# Altium project Sbot_Project.PrjPcb
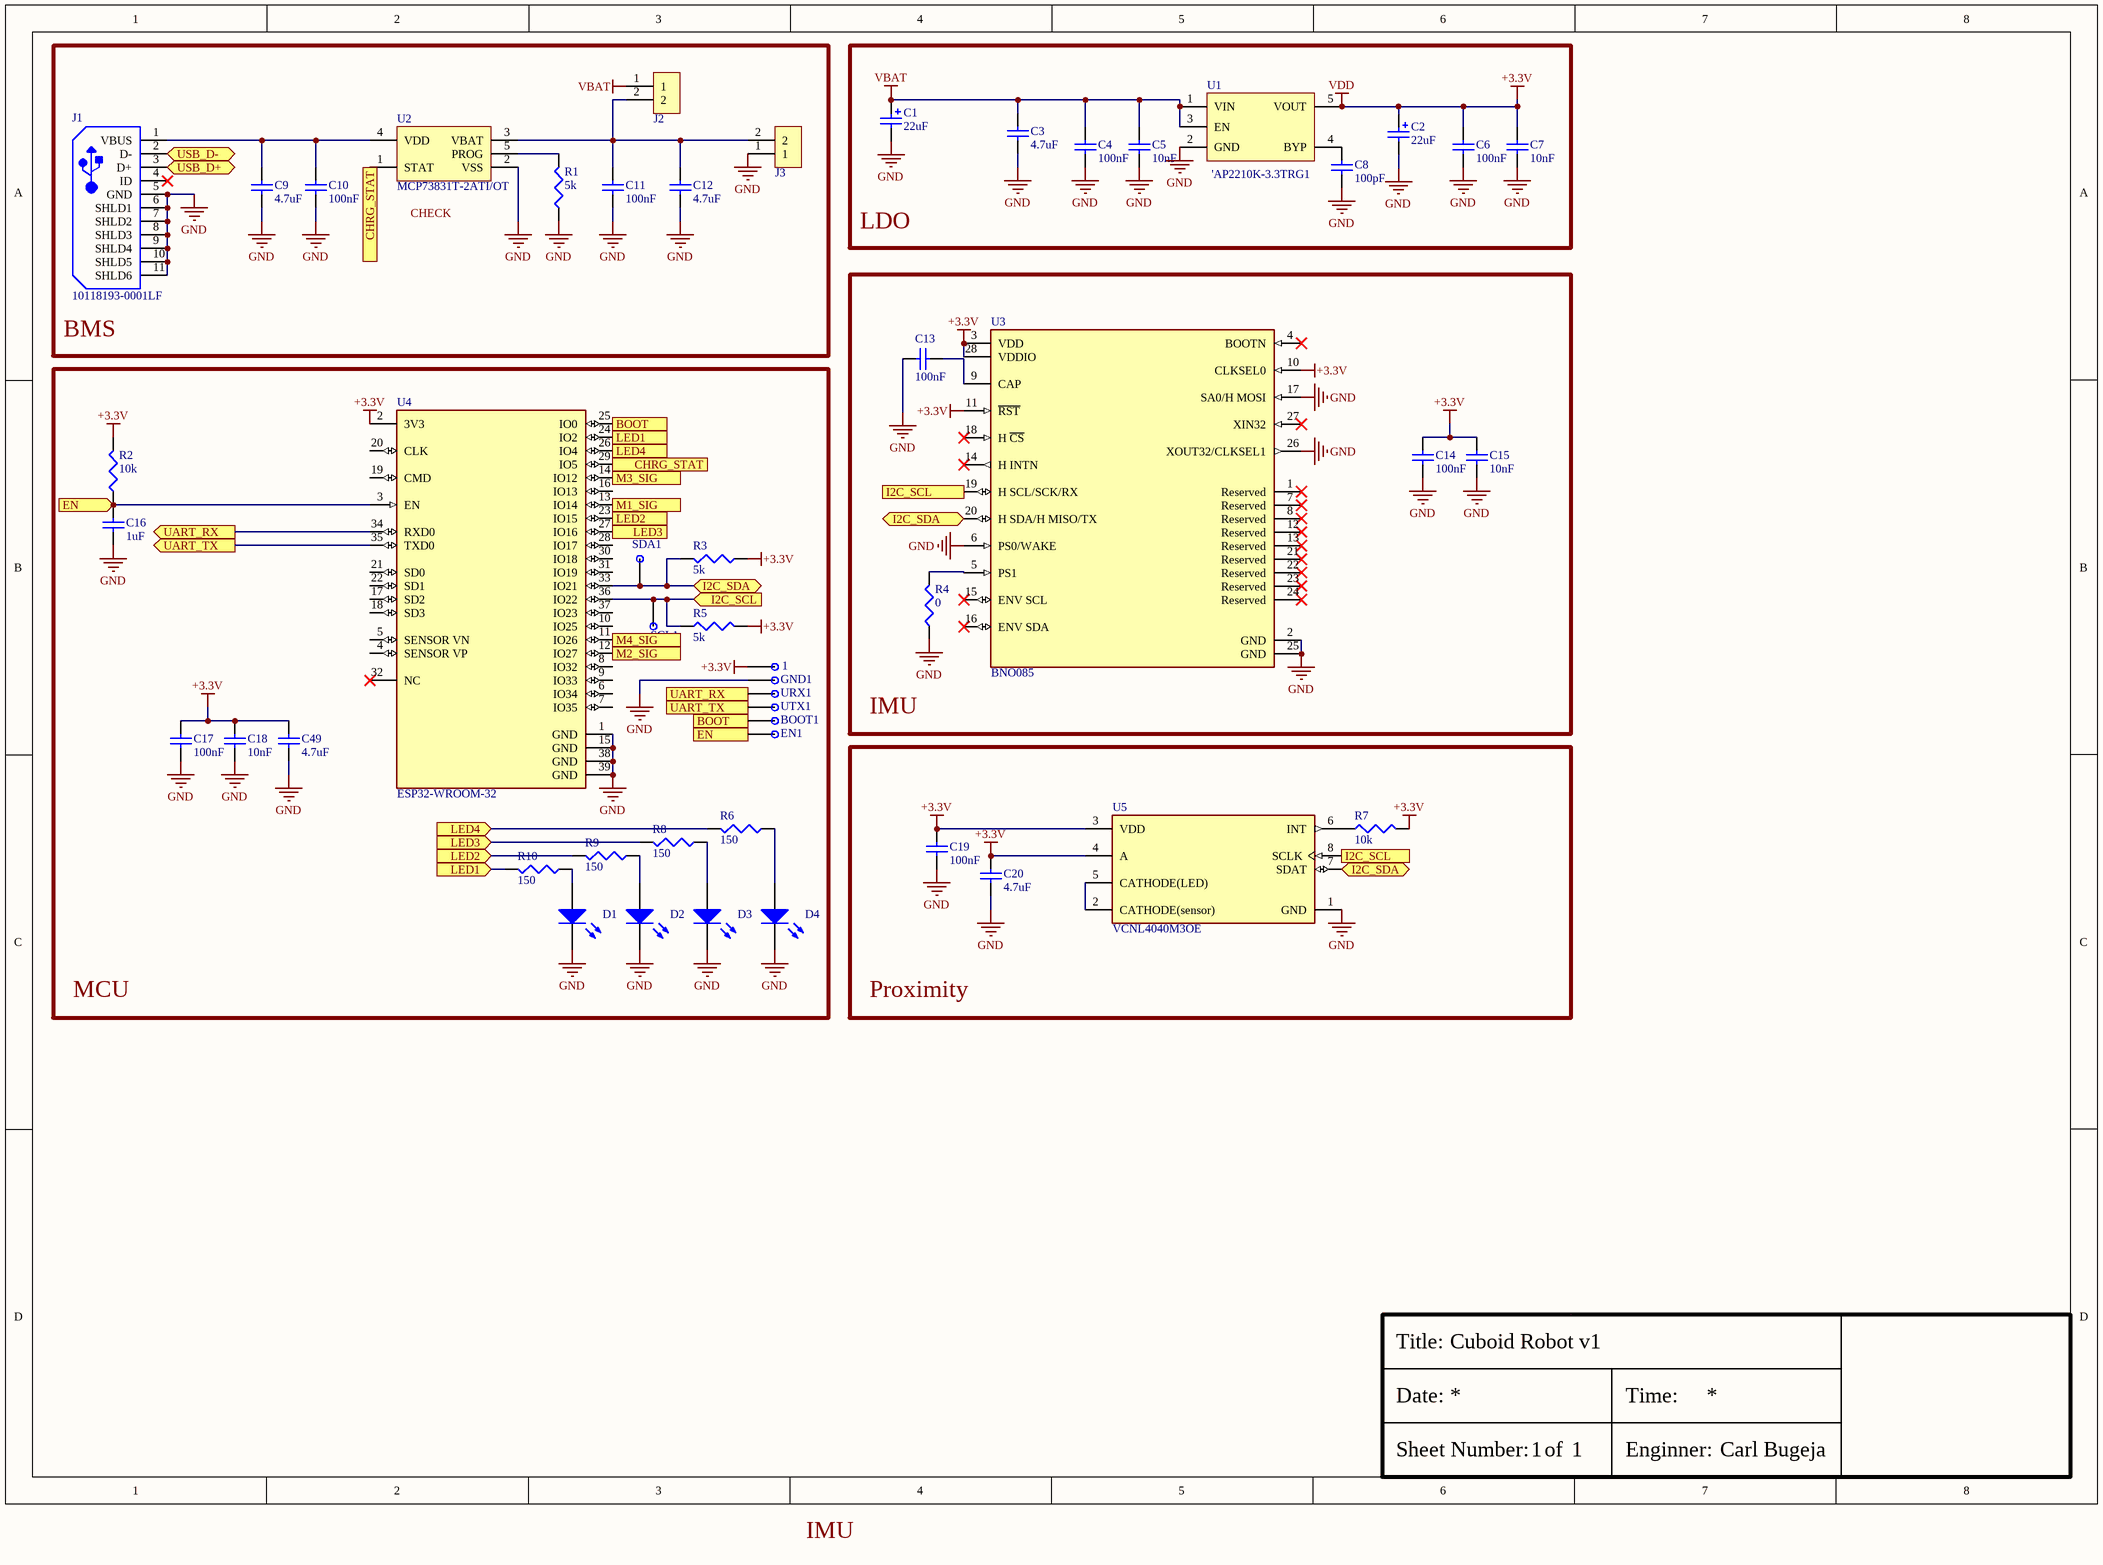
[diagram p0: Sheet1.SchDoc]
Title: Cuboid Robot v1
2 sheets, 119 parts. Net scope: flat (ports and power ports of the same name join across sheets).
Board file: PCB1.PcbDoc
Sheets:
  Sheet1.SchDoc
  Sheet2.SchDoc

## Sheet Sheet1.SchDoc: Cuboid Robot v1
size A3; SheetNumber: 1; SheetTotal: 2

### Parts
1  TESTPAD  [TESTPAD]  (value not drawn)
BOOT1  TESTPAD  [TESTPAD]  (value not drawn)
C1  22uF  [CAPAE4343X55M]
C2  22uF  [CAPAE4343X55M]
C3  4.7uF  [RESC1005X03N]
C4  100nF  [RESC1005X03N]
C5  10nF  [RESC1005X03N]
C6  100nF  [RESC1005X03N]
C7  10nF  [RESC1005X03N]
C8  100pF  [RESC1005X03N]
C9  4.7uF  [RESC1005X03N]
C10  100nF  [RESC1005X03N]
C11  100nF  [RESC1005X03N]
C12  4.7uF  [RESC1005X03N]
C13  100nF  [RESC1005X03N]
C14  100nF  [RESC1005X03N]
C15  10nF  [RESC1005X03N]
C16  1uF  [RESC1005X03N]
C17  100nF  [RESC1005X03N]
C18  10nF  [RESC1005X03N]
C19  100nF  [RESC1005X03N]
C20  4.7uF  [RESC1005X03N]
C49  4.7uF  [RESC1005X03N]
D1  156120VS75000  [1206  RECTANGULAR-REVERSE USE]  (value not drawn)
D2  156120VS75000  [1206  RECTANGULAR-REVERSE USE]  (value not drawn)
D3  156120VS75000  [1206  RECTANGULAR-REVERSE USE]  (value not drawn)
D4  156120VS75000  [1206  RECTANGULAR-REVERSE USE]  (value not drawn)
EN1  TESTPAD  [TESTPAD]  (value not drawn)
GND1  TESTPAD  [TESTPAD]  (value not drawn)
J1  10118193-0001LF  [FCI-10118193-0001LF-5_V]
J2  H2P2.54  [M20-8890245R]  (value not drawn)
J3  H2P2.54  [T2P2.54]  (value not drawn)
R1  5k  [RESC1005X03N]
R2  10k  [RESC1005X03N]
R3  5k  [RESC1005X03N]
R4  0  [RESC1005X03N]
R5  5k  [RESC1005X03N]
R6  150  [RESC1005X03N]
R7  10k  [RESC1005X03N]
R8  150  [RESC1005X03N]
R9  150  [RESC1005X03N]
R10  150  [RESC1005X03N]
SCL1  TESTPAD  [TESTPAD]  (value not drawn)
SDA1  TESTPAD  [TESTPAD]  (value not drawn)
U1  'AP2210K-3.3TRG1  [SOT95P282X145-5N]
U2  MCP73831T-2ATI/OT  [SOT95P270X145-5N]
U3  BNO085  [FP-BNO085-MFG]
U4  ESP32-WROOM-32  [FP-ESP32-WROOM-32-MFG]
U5  VCNL4040M3OE  [FP-VCNL4040M3OE-MFG]
URX1  TESTPAD  [TESTPAD]  (value not drawn)
UTX1  TESTPAD  [TESTPAD]  (value not drawn)

### Blocks framed on the sheet
BMS: C9-C12 J1-J3 R1 U2
LDO: C1-C8 U1
IMU: C13-C15 R4 U3
MCU: 1 BOOT1 C16-C18 C49 D1-D4 EN1 GND1 R2 R3 R5 R6 R8-R10 SCL1 SDA1 U4 URX1 UTX1
Proximity: C19 C20 R7 U5

### Ports
BOOT (in), BOOT (out), CHRG_STAT (in), EN (in), I2C_SCL (in), I2C_SDA (bidir), LED1 (in), LED1 (out), LED2 (in), LED2 (out), LED3 (in), LED3 (out), LED4 (in), LED4 (out), M1_SIG (out), M2_SIG (out), M3_SIG (out), M4_SIG (out), UART_RX (in), UART_RX (out), UART_TX (in), UART_TX (out), USB_D+ (bidir), USB_D- (bidir)

### Nets
+3.3V: 1.1 C2.1 C6.1 C7.1 C14.1 C15.1 C17.1 C18.1 C19.1 C20.1 C49.1 R2.2 R3.1 R5.2 R7.2 U1.5(VOUT) U3.3(VDD) U3.10(CLKSEL0) U3.11(~{RST}) U3.28(VDDIO) U4.2(3V3) U5.3(VDD) U5.4(A)  [also labelled VDD]
GND: C1.2 C2.2 C3.2 C4.2 C5.2 C6.2 C7.2 C8.2 C9.2 C10.2 C11.2 C12.2 C13.1 C14.2 C15.2 C16.2 C17.2 C18.2 C19.2 C20.2 C49.2 D1.1(K) D2.1(K) D3.1(K) D4.1(K) GND1.1 J1.5(GND) J1.6(SHLD1) J1.7(SHLD2) J1.8(SHLD3) J1.9(SHLD4) J1.10(SHLD5) J1.11(SHLD6) J3.1 R1.1 R4.1 U1.2(GND) U2.2(VSS) U3.2(GND) U3.6(PS0/WAKE) U3.17(SA0/H_MOSI) U3.25(GND) U3.26(XOUT32/CLKSEL1) U4.1(GND) U4.15(GND) U4.38(GND) U4.39(GND) U5.1(GND)
VBAT: C1.1 C3.1 C4.1 C5.1 J2.1 U1.1(VIN) U1.3(EN)
NetBOOT1_1: BOOT1.1 U4.25(IO0) ; port BOOT
NetC8_1: C8.1 U1.4(BYP)
NetC9_1: C9.1 C10.1 J1.1(VBUS) U2.4(VDD)
NetC11_1: C11.1 C12.1 J2.2 J3.2 U2.3(VBAT)
NetC13_2: C13.2 U3.9(CAP)
NetC16_1: C16.1 EN1.1 R2.1 U4.3(EN) ; port EN
NetD1_2: D1.2(A) R10.1
NetD2_2: D2.2(A) R9.1
NetD3_2: D3.2(A) R8.1
NetD4_2: D4.2(A) R6.1
NetJ1_2: J1.2(D-) ; port USB_D-
NetJ1_3: J1.3(D+) ; port USB_D+
NetR1_2: R1.2 U2.5(PROG)
NetR3_2: R3.2 SDA1.1 U3.20(H_SDA/H_MISO/TX) U4.33(IO21) U5.7(SDAT) ; port I2C_SDA
NetR4_2: R4.2 U3.5(PS1)
NetR5_1: R5.1 SCL1.1 U3.19(H_SCL/SCK/RX) U4.36(IO22) U5.8(SCLK) ; port I2C_SCL
NetR6_2: R6.2 U4.26(IO4) ; port LED4
NetR7_1: R7.1 U5.6(INT)
NetR8_2: R8.2 U4.27(IO16) ; port LED3
NetR9_2: R9.2 U4.23(IO15) ; port LED2
NetR10_2: R10.2 U4.24(IO2) ; port LED1
NetU2_1: U2.1(STAT) U4.29(IO5) ; port CHRG_STAT
NetU4_11: U4.11(IO26) ; port M4_SIG
NetU4_12: U4.12(IO27) ; port M2_SIG
NetU4_13: U4.13(IO14) ; port M1_SIG
NetU4_14: U4.14(IO12) ; port M3_SIG
NetU4_34: U4.34(RXD0) URX1.1 ; port UART_RX
NetU4_35: U4.35(TXD0) UTX1.1 ; port UART_TX
NetU5_2: U5.2(CATHODE(sensor)) U5.5(CATHODE(LED))

Not connected (* = marked no-connect by the designer): J1 4(ID)*; U3 1(Reserved)* 4(BOOTN)* 7(Reserved)* 8(Reserved)* 12(Reserved)* 13(Reserved)* 14(H_INTN)* 15(ENV_SCL)* 16(ENV_SDA)* 18(H_~{CS})* 21(Reserved)* 22(Reserved)* 23(Reserved)* 24(Reserved)* 27(XIN32)*; U4 4(SENSOR_VP) 5(SENSOR_VN) 6(IO34) 7(IO35) 8(IO32) 9(IO33) 10(IO25) 16(IO13) 17(SD2) 18(SD3) 19(CMD) 20(CLK) 21(SD0) 22(SD1) 28(IO17) 30(IO18) 31(IO19) 32(NC)* 37(IO23)

### Notes on the sheet
- (near U2) CHECK
- IMU
- Title:
- Cuboid Robot v1
- Date:
- Sheet Number:
- 1
- of
- Enginner:
- Time:
- Carl Bugeja

### Library data of the parts
C1 C2 = CAP*
C3-C20 C49 = CAP
D1-D4 = CMP-1428-00009-1: SMD mono-color reverse mount waterclear Chip LED, WL-SMRW, Bright Green; Manufacturer: Wuerth Elektronik; Lens Type: Rectangular; ComponentLink1Description: Manufacturer URL; Color: Bright Green; ComponentLink2Description: Datasheet; PackageReference: 1206  RECTANGULAR-REVERSE USE; ComponentLink1URL: http://www.we-online.com; ComponentLink2URL: http://katalog.we-online.com/led/datasheet/156120VS75000.pdf; PartNumber: 156120VS75000
J1 = CMP-2000-05119-1: Micro USB B Type Receptacle, -55 to 85 degC, 5-Pin SMD, RoHS, Tape and Reel; Manufacturer: FCI; Insulation Resistance: 1000MOhms; Gender: Female; Current Rating: 1.8A; Number of Contacts: 5Contact; Connector Type: MicroUSBTypeBreceptacle; Mounting Angle: Right; Datasheet Version: Rev. C, 05/2015; Packaging: Reel; Product Category: USBConnectors; Standard: USB2.0; Factory Pack Quantity: 1200; Operating Temperature Range: -55Cto+85C; Termination Style: SMD/SMT; Datasheet URL: http://datasheet.octopart.com/10118193-0001LF-FCI-datasheet-55953155.pdf; Contact Material: CopperAlloy; RoHS: Details; Contact Plating: Gold; Flammability Rating: UL94V-0; Manufacturer URL: http://www.fci.com/; Brand: FCI; Product: MicroUSBTypeBConnectors; Color: Black
R1-R10 = RES
U1 = AP2210K-3.0TRG1
U3 = CMP-197298-000001-1: IMU ACCEL/GYRO/MAG I2C 32BIT; Manufacturer: Hillcrest Laboratories, Inc.; Sensor Type: Accelerometer,Gyroscope,Magnetometer; Max Supply Voltage: 3.6V; Sensor Output: I2C,SPI,UART; Accel Range: 8g; Min Supply Voltage: 1.7V; Temperature Range High: +85°C; ComponentLink2URL: https://www.hillcrestlabs.com/download/5a747b8d566d073a5d000536; Octopart: https://octopart.com/bno085-hillcrest+laboratories-92813482; Height: 1.18mm; Device Class L1: Sensors; Digikey Description: IMU ACCEL/GYRO/MAG I2C 32BIT; Automotive: No; Package: BNO085; Device Class L3: Inertial Measurement Units (IMUs); Temperature: -40°C to +85°C; Category: IC; Device Class L2: Motion Sensors; Lead Free: Yes; Manufacturer Part Number: BNO085; Temperature Range Low: -40°C; RoHS: TRUE; ComponentLink2Description: Datasheet
U4 = CMP-194065-000008-1: RX TXRX MOD WIFI SURFACE MOUNT; Frequency: 2.5GHz; Sensitivity: -98dBm; Operating Supply Voltage: 3.6V; Data Rate: 150Mbps; Weight: 0.088185oz; Package Quantity: 550; Min Operating Temperature: -40°C; Mount: Surface Mount; Max Operating Temperature: 85°C; Packaging: Cut Tape; Case/Package: SMD/SMT
U5 = CMP-02530-000002-1: SENSOR OPT 550NM AMBIENT 8SMD; Manufacturer: Vishay; Sensor Output: I2C; Max Supply Voltage: 3.6V; Min Supply Voltage: 2.5V; Operating Supply Current: 0.2-300uA; ComponentLink2Description: Datasheet; Temperature: -40°C to +85°C; Device Class L2: Optical Sensors; Digikey Description: SENSOR OPT 550NM AMBIENT 8SMD; Package: 0; ComponentLink2URL: https://www.vishay.com/docs/84274/vcnl4040.pdf; Device Class L3: unset; Temperature Range High: +85°C; Height: 1.15mm; Ambient Temperature Range High: +85°C; Lead Free: Yes; Ambient Temperature Range Low: -40°C; Automotive: No; RoHS: TRUE; Category: IC; Device Class L1: Sensors; Temperature Range Low: -40°C; Octopart: https://octopart.com/vcnl4040m3oe-vishay-56243155; Manufacturer Part Number: VCNL4040M3OE

## Sheet Sheet2.SchDoc: Cuboid Robot v1
size A3; SheetNumber: 2; SheetTotal: 2
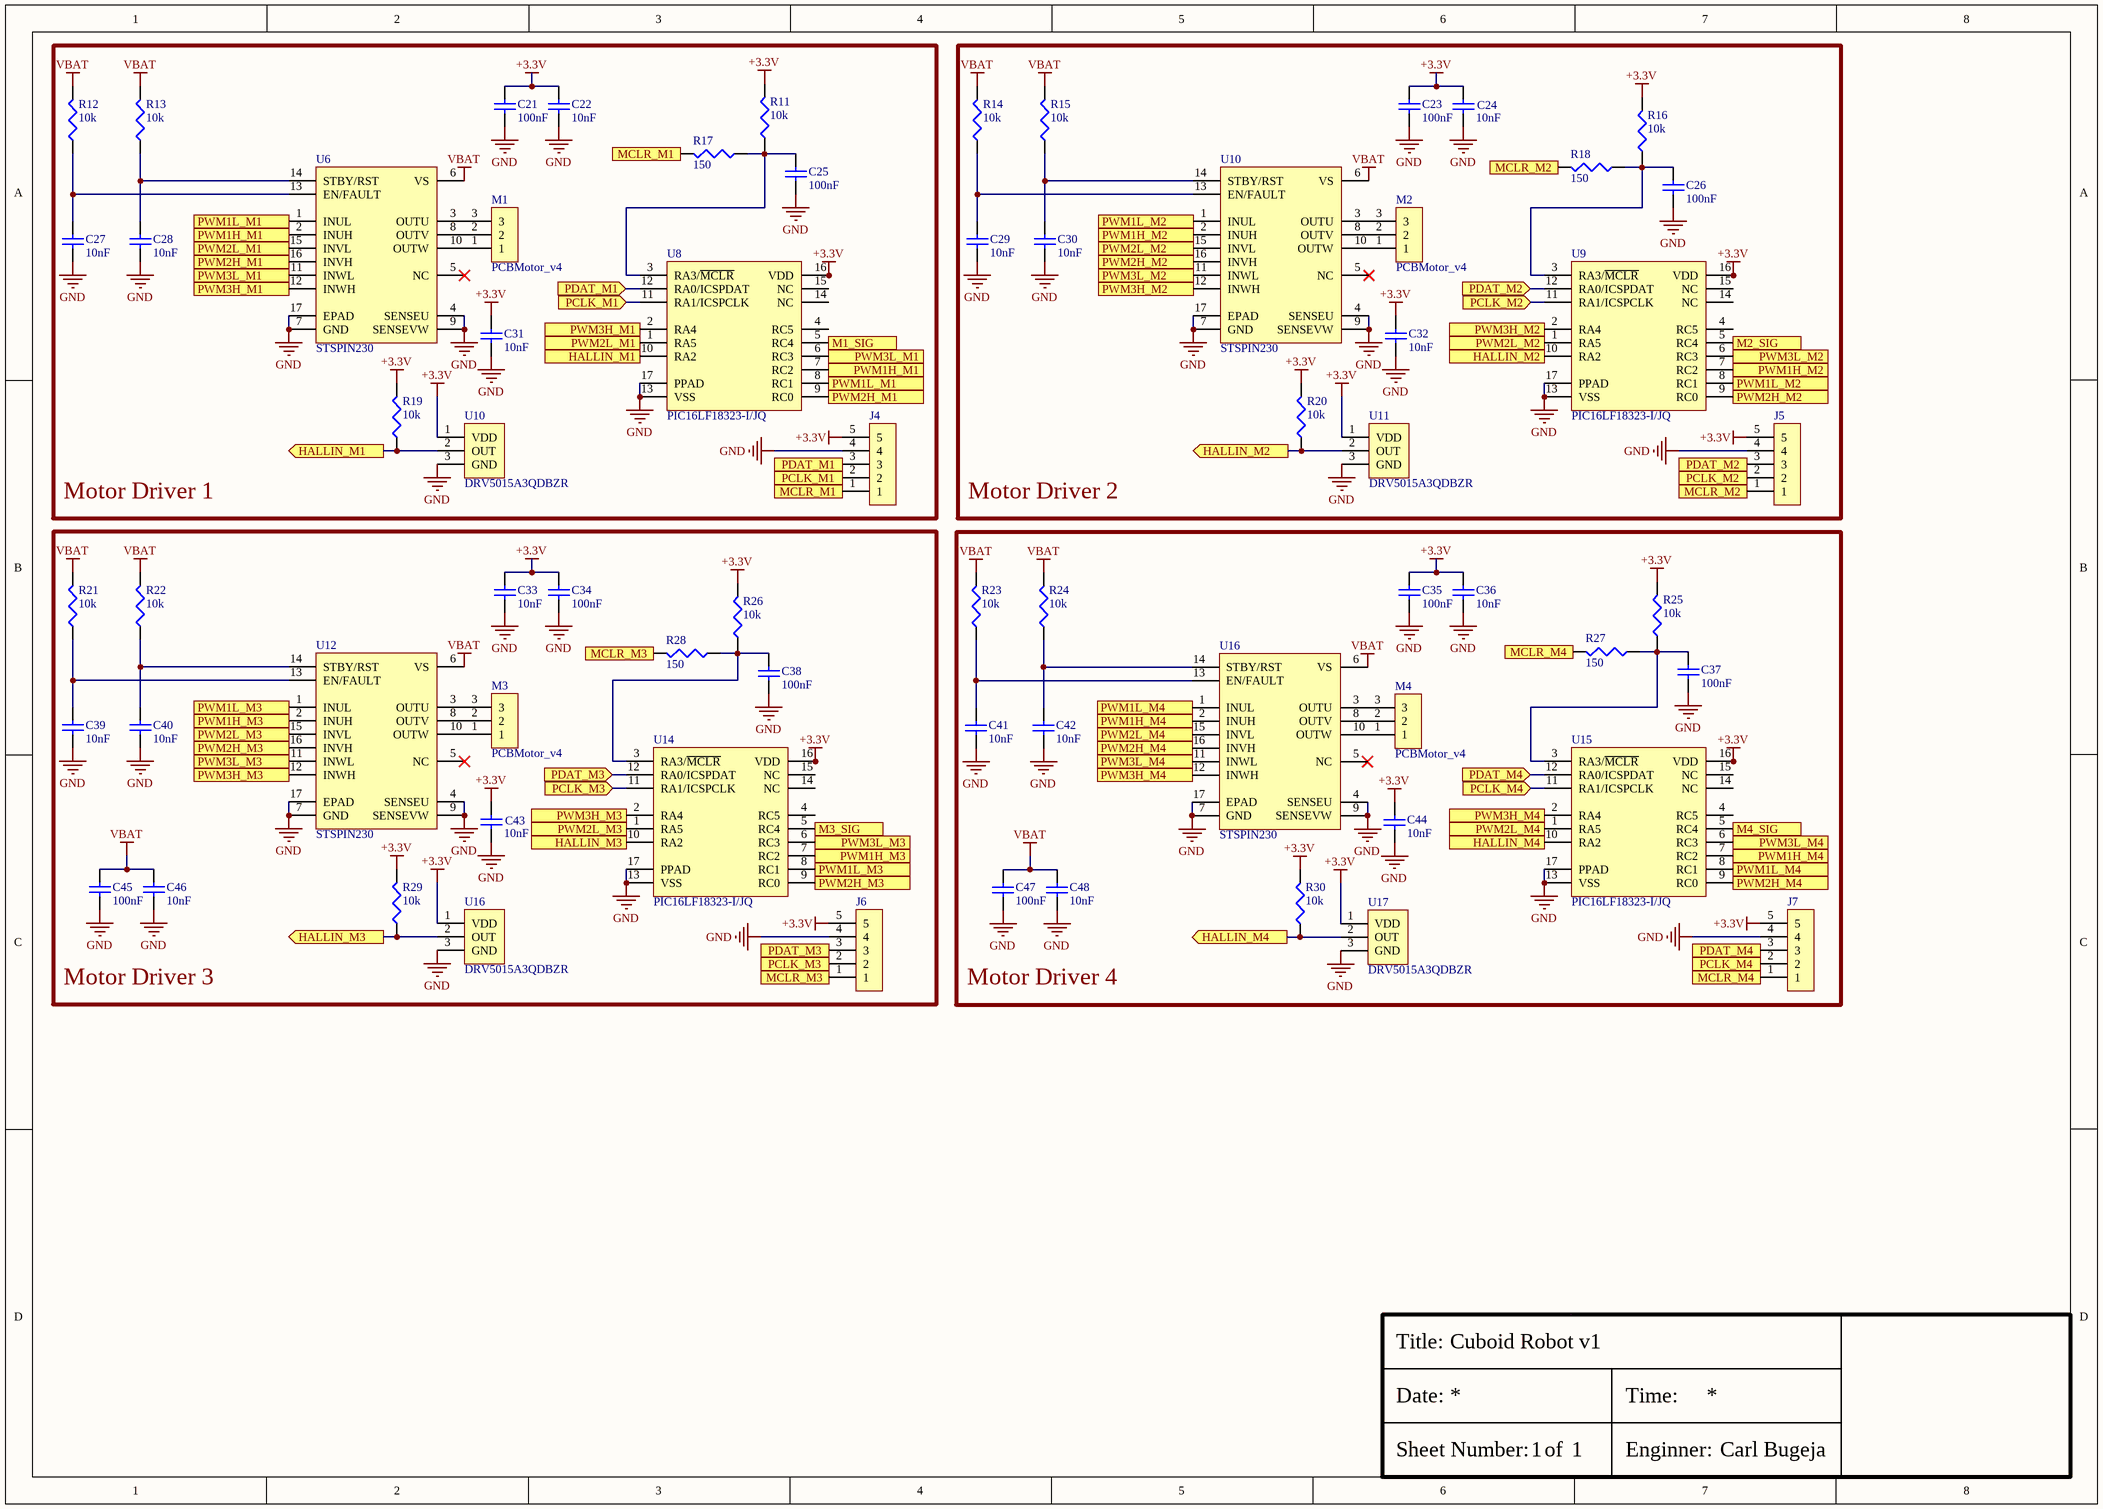
[diagram p1: Sheet2.SchDoc]

### Parts
(Parts that share a designator on the sheet are numbered #1, #2 ... from top to bottom, then left to right.)
C21  100nF  [RESC1005X03N]
C22  10nF  [RESC1005X03N]
C23  100nF  [RESC1005X03N]
C24  10nF  [RESC1005X03N]
C25  100nF  [RESC1005X03N]
C26  100nF  [RESC1005X03N]
C27  10nF  [RESC1005X03N]
C28  10nF  [RESC1005X03N]
C29  10nF  [RESC1005X03N]
C30  10nF  [RESC1005X03N]
C31  10nF  [RESC1005X03N]
C32  10nF  [RESC1005X03N]
C33  10nF  [RESC1005X03N]
C34  100nF  [RESC1005X03N]
C35  100nF  [RESC1005X03N]
C36  10nF  [RESC1005X03N]
C37  100nF  [RESC1005X03N]
C38  100nF  [RESC1005X03N]
C39  10nF  [RESC1005X03N]
C40  10nF  [RESC1005X03N]
C41  10nF  [RESC1005X03N]
C42  10nF  [RESC1005X03N]
C43  10nF  [RESC1005X03N]
C44  10nF  [RESC1005X03N]
C45  100nF  [RESC1005X03N]
C46  10nF  [RESC1005X03N]
C47  100nF  [RESC1005X03N]
C48  10nF  [RESC1005X03N]
J4  H5P1.27  [H5P1.27P]  (value not drawn)
J5  H5P1.27  [H5P1.27P]  (value not drawn)
J6  H5P1.27  [H5P1.27P]  (value not drawn)
J7  H5P1.27  [H5P1.27P]  (value not drawn)
M1  PCBMotor_v4  [PCBMotor_v4]
M2  PCBMotor_v4  [PCBMotor_v4]
M3  PCBMotor_v4  [PCBMotor_v4]
M4  PCBMotor_v4  [PCBMotor_v4]
R11  10k  [RESC1005X03N]
R12  10k  [RESC1005X03N]
R13  10k  [RESC1005X03N]
R14  10k  [RESC1005X03N]
R15  10k  [RESC1005X03N]
R16  10k  [RESC1005X03N]
R17  150  [RESC1005X03N]
R18  150  [RESC1005X03N]
R19  10k  [RESC1005X03N]
R20  10k  [RESC1005X03N]
R21  10k  [RESC1005X03N]
R22  10k  [RESC1005X03N]
R23  10k  [RESC1005X03N]
R24  10k  [RESC1005X03N]
R25  10k  [RESC1005X03N]
R26  10k  [RESC1005X03N]
R27  150  [RESC1005X03N]
R28  150  [RESC1005X03N]
R29  10k  [RESC1005X03N]
R30  10k  [RESC1005X03N]
U6  STSPIN230  [QFN50P300X300X100_HS-17N]
U8  PIC16LF18323-I/JQ  [PIC16F18323-I/JQ]
U9  PIC16LF18323-I/JQ  [PIC16F18323-I/JQ]
U10#1  STSPIN230  [QFN50P300X300X100_HS-17N]
U10#2  DRV5015A3QDBZR  [SOT95P237X95-3N]
U11  DRV5015A3QDBZR  [SOT95P237X95-3N]
U12  STSPIN230  [QFN50P300X300X100_HS-17N]
U14  PIC16LF18323-I/JQ  [PIC16F18323-I/JQ]
U15  PIC16LF18323-I/JQ  [PIC16F18323-I/JQ]
U16#1  STSPIN230  [QFN50P300X300X100_HS-17N]
U16#2  DRV5015A3QDBZR  [SOT95P237X95-3N]
U17  DRV5015A3QDBZR  [SOT95P237X95-3N]

### Blocks framed on the sheet
Motor Driver 1: C21 C22 C25 C27 C28 C31 J4 M1 R11-R13 R17 R19 U6 U8 U10#2
Motor Driver 2: C23 C24 C26 C29 C30 C32 J5 M2 R14-R16 R18 R20 U9 U10#1 U11
Motor Driver 3: C33 C34 C38-C40 C43 C45 C46 J6 M3 R21 R22 R26 R28 R29 U12 U14 U16#2
Motor Driver 4: C35-C37 C41 C42 C44 C47 C48 J7 M4 R23-R25 R27 R30 U15 U16#1 U17

### Ports
HALLIN_M1 (in), HALLIN_M1 (out), HALLIN_M2 (in), HALLIN_M2 (out), HALLIN_M3 (in), HALLIN_M3 (out), HALLIN_M4 (in), HALLIN_M4 (out), M1_SIG (in), M2_SIG (in), M3_SIG (in), M4_SIG (in), MCLR_M1 (in), MCLR_M1 (out), MCLR_M2 (in), MCLR_M2 (out), MCLR_M3 (in), MCLR_M3 (out), MCLR_M4 (in), MCLR_M4 (out), PCLK_M1 (in), PCLK_M2 (in), PCLK_M3 (in), PCLK_M4 (in), PDAT_M1 (in), PDAT_M2 (in), PDAT_M3 (in), PDAT_M4 (in), PWM1H_M1 (in), PWM1H_M1 (out), PWM1H_M2 (in), PWM1H_M2 (out), PWM1H_M3 (in), PWM1H_M3 (out), PWM1H_M4 (in), PWM1H_M4 (out), PWM1L_M1 (in), PWM1L_M1 (out), PWM1L_M2 (in), PWM1L_M2 (out), PWM1L_M3 (in), PWM1L_M3 (out), PWM1L_M4 (in), PWM1L_M4 (out), PWM2H_M1 (in), PWM2H_M1 (out), PWM2H_M2 (in), PWM2H_M2 (out), PWM2H_M3 (in), PWM2H_M3 (out), PWM2H_M4 (in), PWM2H_M4 (out), PWM2L_M1 (in), PWM2L_M1 (out), PWM2L_M2 (in), PWM2L_M2 (out), PWM2L_M3 (in), PWM2L_M3 (out), PWM2L_M4 (in), PWM2L_M4 (out), PWM3H_M1 (in), PWM3H_M1 (out), PWM3H_M2 (in), PWM3H_M2 (out), PWM3H_M3 (in), PWM3H_M3 (out), PWM3H_M4 (in), PWM3H_M4 (out), PWM3L_M1 (in), PWM3L_M1 (out), PWM3L_M2 (in), PWM3L_M2 (out), PWM3L_M3 (in), PWM3L_M3 (out), PWM3L_M4 (in), PWM3L_M4 (out)

### Nets
+3.3V: C21.1 C22.1 C23.1 C24.1 C31.1 C32.1 C33.1 C34.1 C35.1 C36.1 C43.1 C44.1 J4.5 J5.5 J6.5 J7.5 R11.2 R16.2 R19.2 R20.2 R25.2 R26.2 R29.2 R30.2 U8.16(VDD) U9.16(VDD) U10#2.1(VDD) U11.1(VDD) U14.16(VDD) U15.16(VDD) U16#2.1(VDD) U17.1(VDD)
GND: C21.2 C22.2 C23.2 C24.2 C25.2 C26.2 C27.2 C28.2 C29.2 C30.2 C31.2 C32.2 C33.2 C34.2 C35.2 C36.2 C37.2 C38.2 C39.2 C40.2 C41.2 C42.2 C43.2 C44.2 C45.2 C46.2 C47.2 C48.2 J4.4 J5.4 J6.4 J7.4 U6.4(SENSEU) U6.7(GND) U6.9(SENSEVW) U6.17(EPAD) U8.13(VSS) U8.17(PPAD) U9.13(VSS) U9.17(PPAD) U10#1.4(SENSEU) U10#1.7(GND) U10#1.9(SENSEVW) U10#1.17(EPAD) U10#2.3(GND) U11.3(GND) U12.4(SENSEU) U12.7(GND) U12.9(SENSEVW) U12.17(EPAD) U14.13(VSS) U14.17(PPAD) U15.13(VSS) U15.17(PPAD) U16#1.4(SENSEU) U16#1.7(GND) U16#1.9(SENSEVW) U16#1.17(EPAD) U16#2.3(GND) U17.3(GND)
VBAT: C45.1 C46.1 C47.1 C48.1 R12.2 R13.2 R14.2 R15.2 R21.2 R22.2 R23.2 R24.2 U6.6(VS) U10#1.6(VS) U12.6(VS) U16#1.6(VS)
NetC25_1: C25.1 R11.1 R17.1 U8.3(RA3/~{MCLR})
NetC26_1: C26.1 R16.1 R18.1 U9.3(RA3/~{MCLR})
NetC27_1: C27.1 R12.1 U6.13(EN/FAULT)
NetC28_1: C28.1 R13.1 U6.14(STBY/RST)
NetC29_1: C29.1 R14.1 U10#1.13(EN/FAULT)
NetC30_1: C30.1 R15.1 U10#1.14(STBY/RST)
NetC37_1: C37.1 R25.1 R27.1 U15.3(RA3/~{MCLR})
NetC38_1: C38.1 R26.1 R28.1 U14.3(RA3/~{MCLR})
NetC39_1: C39.1 R21.1 U12.13(EN/FAULT)
NetC40_1: C40.1 R22.1 U12.14(STBY/RST)
NetC41_1: C41.1 R23.1 U16#1.13(EN/FAULT)
NetC42_1: C42.1 R24.1 U16#1.14(STBY/RST)
NetJ4_1: J4.1 R17.2 ; port MCLR_M1
NetJ4_2: J4.2 U8.11(RA1/ICSPCLK) ; port PCLK_M1
NetJ4_3: J4.3 U8.12(RA0/ICSPDAT) ; port PDAT_M1
NetJ5_1: J5.1 R18.2 ; port MCLR_M2
NetJ5_2: J5.2 U9.11(RA1/ICSPCLK) ; port PCLK_M2
NetJ5_3: J5.3 U9.12(RA0/ICSPDAT) ; port PDAT_M2
NetJ6_1: J6.1 R28.2 ; port MCLR_M3
NetJ6_2: J6.2 U14.11(RA1/ICSPCLK) ; port PCLK_M3
NetJ6_3: J6.3 U14.12(RA0/ICSPDAT) ; port PDAT_M3
NetJ7_1: J7.1 R27.2 ; port MCLR_M4
NetJ7_2: J7.2 U15.11(RA1/ICSPCLK) ; port PCLK_M4
NetJ7_3: J7.3 U15.12(RA0/ICSPDAT) ; port PDAT_M4
NetM1_1: M1.1 U6.10(OUTW)
NetM1_2: M1.2 U6.8(OUTV)
NetM1_3: M1.3 U6.3(OUTU)
NetM2_1: M2.1 U10#1.10(OUTW)
NetM2_2: M2.2 U10#1.8(OUTV)
NetM2_3: M2.3 U10#1.3(OUTU)
NetM3_1: M3.1 U12.10(OUTW)
NetM3_2: M3.2 U12.8(OUTV)
NetM3_3: M3.3 U12.3(OUTU)
NetM4_1: M4.1 U16#1.10(OUTW)
NetM4_2: M4.2 U16#1.8(OUTV)
NetM4_3: M4.3 U16#1.3(OUTU)
NetR19_1: R19.1 U8.10(RA2) U10#2.2(OUT) ; port HALLIN_M1
NetR20_1: R20.1 U9.10(RA2) U11.2(OUT) ; port HALLIN_M2
NetR29_1: R29.1 U14.10(RA2) U16#2.2(OUT) ; port HALLIN_M3
NetR30_1: R30.1 U15.10(RA2) U17.2(OUT) ; port HALLIN_M4
NetU4_11: U15.5(RC4) ; port M4_SIG
NetU4_12: U9.5(RC4) ; port M2_SIG
NetU4_13: U8.5(RC4) ; port M1_SIG
NetU4_14: U14.5(RC4) ; port M3_SIG
NetU6_1: U6.1(INUL) U8.8(RC1) ; port PWM1L_M1
NetU6_2: U6.2(INUH) U8.7(RC2) ; port PWM1H_M1
NetU6_11: U6.11(INWL) U8.6(RC3) ; port PWM3L_M1
NetU6_12: U6.12(INWH) U8.2(RA4) ; port PWM3H_M1
NetU6_15: U6.15(INVL) U8.1(RA5) ; port PWM2L_M1
NetU6_16: U6.16(INVH) U8.9(RC0) ; port PWM2H_M1
NetU9_1: U9.1(RA5) U10#1.15(INVL) ; port PWM2L_M2
NetU9_2: U9.2(RA4) U10#1.12(INWH) ; port PWM3H_M2
NetU9_6: U9.6(RC3) U10#1.11(INWL) ; port PWM3L_M2
NetU9_7: U9.7(RC2) U10#1.2(INUH) ; port PWM1H_M2
NetU9_8: U9.8(RC1) U10#1.1(INUL) ; port PWM1L_M2
NetU9_9: U9.9(RC0) U10#1.16(INVH) ; port PWM2H_M2
NetU12_1: U12.1(INUL) U14.8(RC1) ; port PWM1L_M3
NetU12_2: U12.2(INUH) U14.7(RC2) ; port PWM1H_M3
NetU12_11: U12.11(INWL) U14.6(RC3) ; port PWM3L_M3
NetU12_12: U12.12(INWH) U14.2(RA4) ; port PWM3H_M3
NetU12_15: U12.15(INVL) U14.1(RA5) ; port PWM2L_M3
NetU12_16: U12.16(INVH) U14.9(RC0) ; port PWM2H_M3
NetU15_1: U15.1(RA5) U16#1.15(INVL) ; port PWM2L_M4
NetU15_2: U15.2(RA4) U16#1.12(INWH) ; port PWM3H_M4
NetU15_6: U15.6(RC3) U16#1.11(INWL) ; port PWM3L_M4
NetU15_7: U15.7(RC2) U16#1.2(INUH) ; port PWM1H_M4
NetU15_8: U15.8(RC1) U16#1.1(INUL) ; port PWM1L_M4
NetU15_9: U15.9(RC0) U16#1.16(INVH) ; port PWM2H_M4

Not connected (* = marked no-connect by the designer): U6 5(NC)*; U8 4(RC5) 14(NC) 15(NC); U9 4(RC5) 14(NC) 15(NC); U10#1 5(NC)*; U12 5(NC)*; U14 4(RC5) 14(NC) 15(NC); U15 4(RC5) 14(NC) 15(NC); U16#1 5(NC)*

### Notes on the sheet
- Title:
- Cuboid Robot v1
- Date:
- Sheet Number:
- 1
- of
- Enginner:
- Time:
- Carl Bugeja

### Library data of the parts
C21-C48 = CAP
R11-R30 = RES
U8 U9 U14 U15 = PIC16F18323-I/JQ

## Nets that join several sheets
+3.3V: Sheet1 (23 pins), Sheet2 (32 pins)
GND: Sheet1 (48 pins), Sheet2 (60 pins)
VBAT: Sheet1 (7 pins), Sheet2 (16 pins)
NetU4_11: Sheet1 (U4.11), Sheet2 (U15.5)
NetU4_12: Sheet1 (U4.12), Sheet2 (U9.5)
NetU4_13: Sheet1 (U4.13), Sheet2 (U8.5)
NetU4_14: Sheet1 (U4.14), Sheet2 (U14.5)